# EAGLE design finalPCB2 (EAGLE 9.6.2)
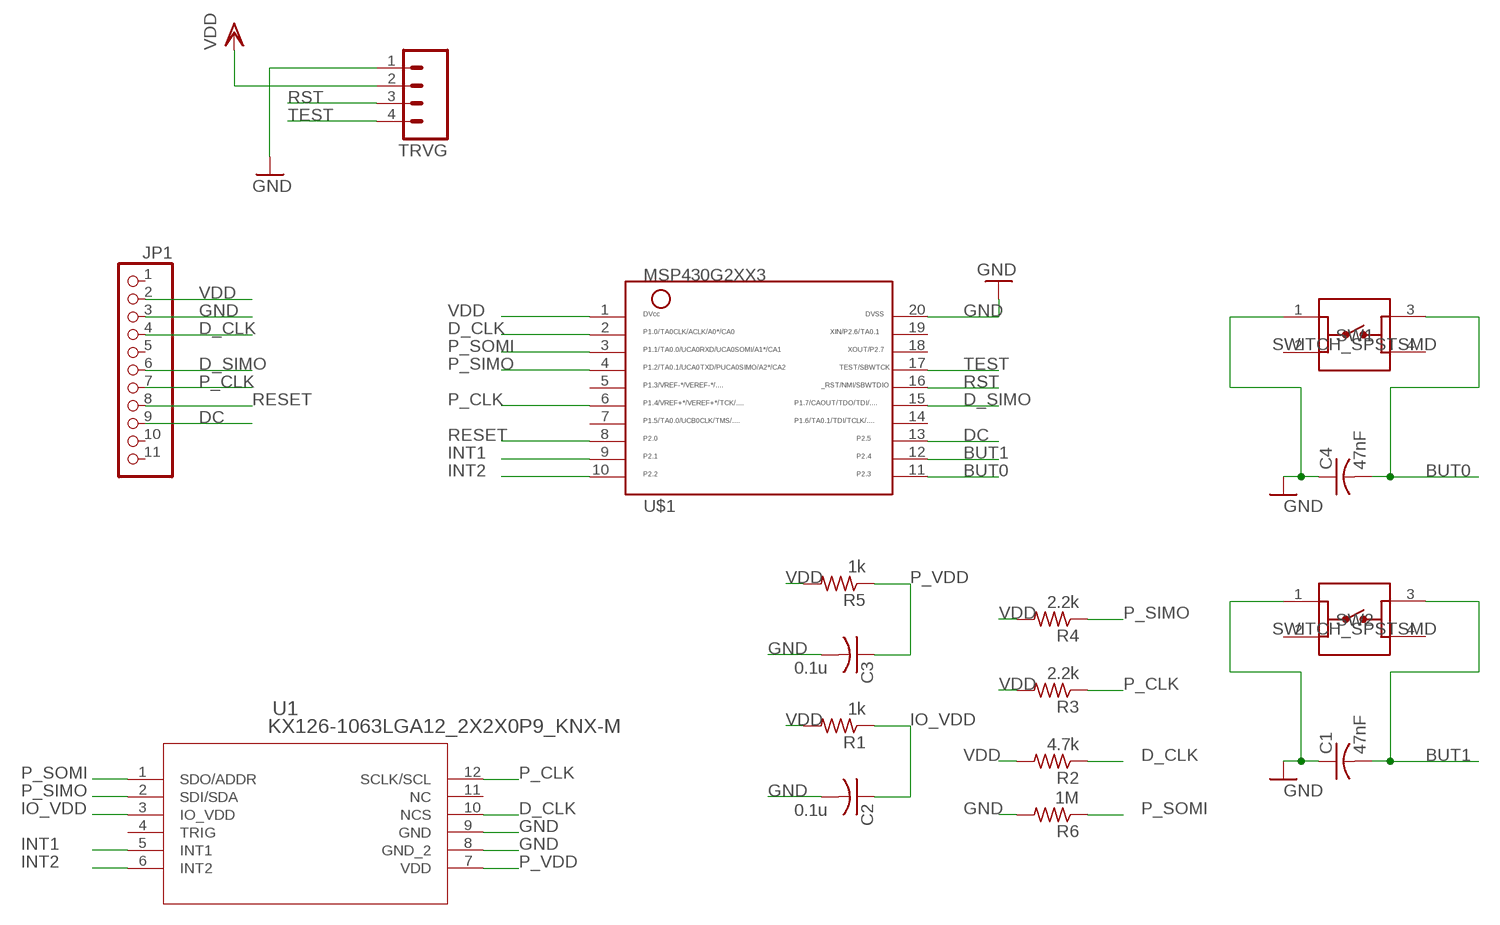
[diagram p0: schematic, sheet 1]

## Parts
C1  47nF  C-USC0603  [C0603]
C2  0.1u  C-USC0603  [C0603]
C3  0.1u  C-USC0603  [C0603]
C4  47nF  C-USC0603  [C0603]
JP1  HEADER-1X11  [1X11_ROUND]
R1  1k  R-US_R0402  [R0402]
R2  4.7k  R-US_R0402  [R0402]
R3  2.2k  R-US_R0402  [R0402]
R4  2.2k  R-US_R0402  [R0402]
R5  1k  R-US_R0402  [R0402]
R6  1M  R-US_R0402  [R0402]
SW1  SWITCH_SPSTSMD  [SW_1571563-4]
SW2  SWITCH_SPSTSMD  [SW_1571563-4]
TRVG  M04LOCK  [1X04_LOCK]
U1  KX126-1063LGA12_2X2X0P9_KNX-M  [LGA12_2X2X0P9_KNX-M]
U$1  MSP430G2XX3TSSOP  [PW20]

## Nets
BUT0: C4.2 SW1.3 U$1.11
BUT1: C1.2 SW2.3 U$1.12
D_CLK: JP1.4 R2.1 U1.10(NCS) U$1.2
D_SIMO: JP1.6 U$1.15
DC: JP1.9 U$1.13
GND: C1.1 C2.2 C3.2 C4.1 JP1.3 R6.2 SW1.1 SW2.1 TRVG.1 U1.8(GND_2) U1.9(GND) U$1.20
INT1: U1.5(INT1) U$1.9
INT2: U1.6(INT2) U$1.10
IO_VDD: C2.1 R1.1 U1.3(IO_VDD)
P_CLK: JP1.7 R3.1 U1.12(SCLK/SCL) U$1.6
P_SIMO: R4.1 U1.2(SDI/SDA) U$1.4
P_SOMI: R6.1 U1.1(SDO/ADDR) U$1.3
P_VDD: C3.1 R5.1 U1.7(VDD)
RESET: JP1.8 U$1.8
RST: TRVG.3 U$1.16
TEST: TRVG.4 U$1.17
VDD: JP1.2 R1.2 R2.2 R3.2 R4.2 R5.2 TRVG.2 U$1.1
Unconnected: JP1.1 JP1.5 JP1.10 JP1.11 SW1.2 SW1.4 SW2.2 SW2.4 U1.4(TRIG) U1.11(NC) U$1.5 U$1.7 U$1.14 U$1.18 U$1.19

## Library data of the parts
C1-C4 = rcl:C-US: CAPACITOR, American symbol; SPICEPREFIX: C
JP1 = microbuilder:HEADER-1X11
R1-R6 = rcl:R-US_: RESISTOR, American symbol; SPICEPREFIX: R
SW1 SW2 = ELEC327:SWITCH_SPST: TE Connectivity Alcoswitch, 6mm Switch Tactile OFF (ON) SPST Round Button PC Pins 0.05A 24VDC 100000Cycles 2.55N Thru-Hole Loose Through Hole Version 1825910-7 <https://www.digikey.com/en/products/detail/te-connectivity-alcoswitch-switches/1825910-7/1731414> Surface Mount Version 1571563-4 <https://www.digikey.com/en/products/detail/te-connectivity-alcoswitch-switches/1571563-4/2400231>
TRVG = Pendant:M04: Header 4 Standard 4-pin 0.1" header. Use with straight break away headers (SKU : PRT-00116), right angle break away headers (PRT-00553), swiss pins (PRT-00743), machine pins (PRT-00117), and female headers (PRT-00115). Molex polarized connector foot print use with SKU : PRT-08231 with associated crimp pins and housings.
U1 = Juan_pedometer:KX126-1063; COPYRIGHT: Copyright (C) 2021 Ultra Librarian. All rights reserved.; DIGI-KEY_PART_NUMBER_1: 1191-1058-2-ND; DIGI-KEY_PART_NUMBER_2: 1191-1058-1-ND; DIGI-KEY_PART_NUMBER_3: 1191-1058-6-ND; MANUFACTURER_PART_NUMBER: KX126-1063; MFR_NAME: Kionix
U$1 = ELEC327:MSP430G2XX3: MSP430G2XX3 PDIP (N) 20 Pin Package

## Board
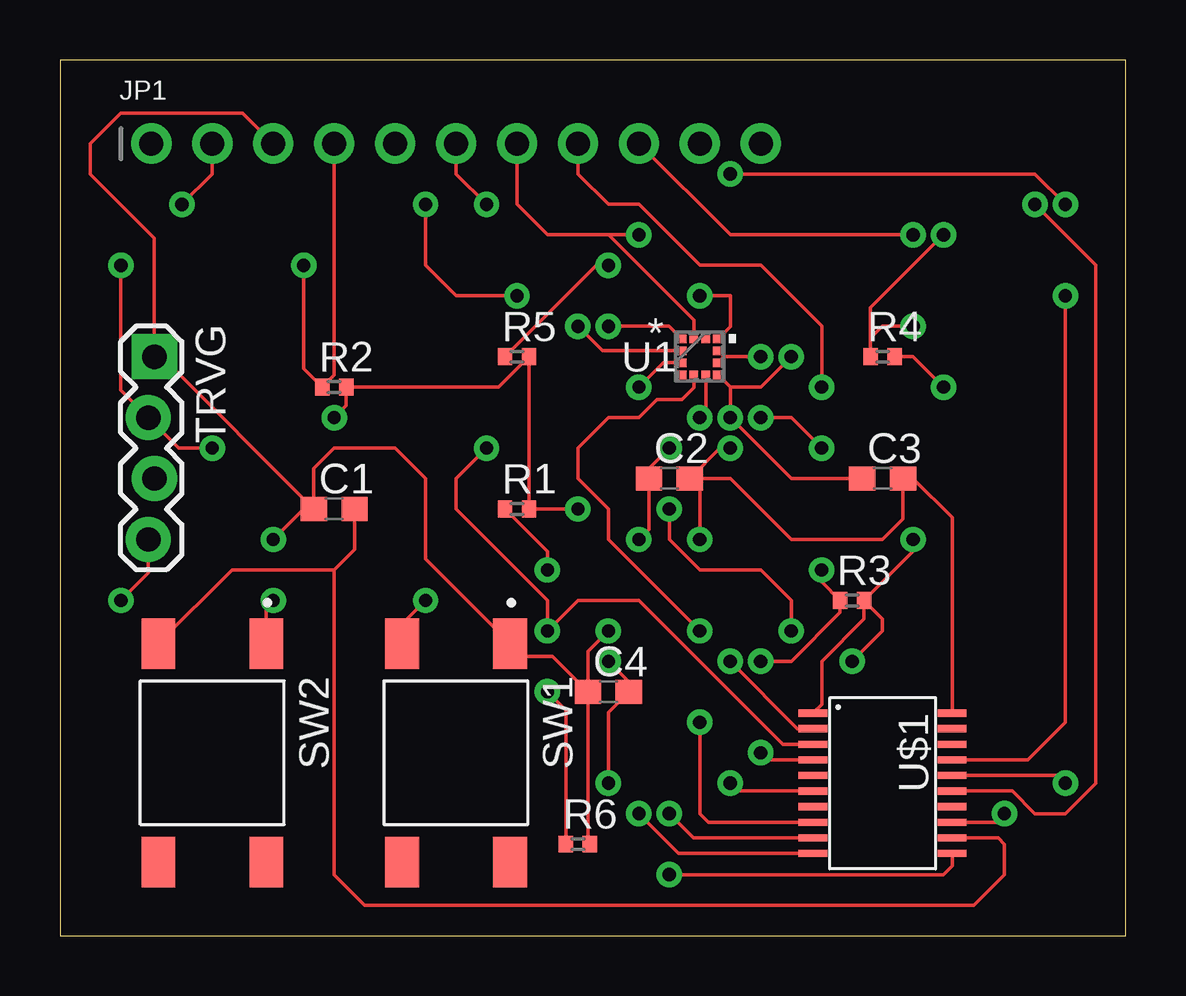
[diagram p1: board, top side]
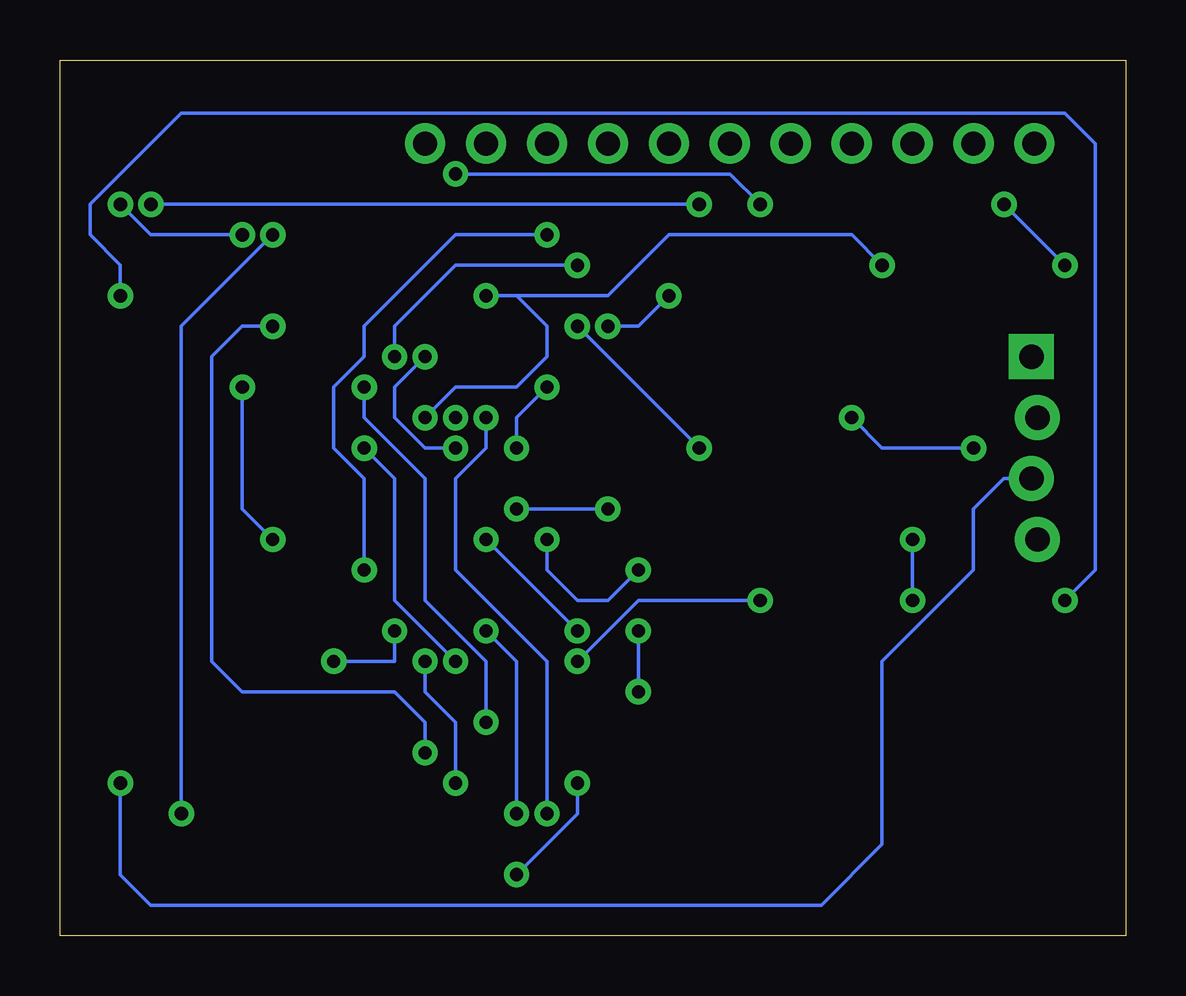
[diagram p2: board, bottom side, seen from below]

Size 44.43 x 36.5 mm. Coordinates in mm from the lower left corner, seen from the top.
Outline: 0,0 44.43,0 44.43,36.5 0,36.5 0,0
Copper layers (1*16): Top 0.035mm / dielectric 1.5mm / Bottom 0.035mm
Design rules "AdvancedCircuitsBarebones": minimum track width 6mil, minimum drill 20mil, track to track 6mil, track to pad 6mil, pad to pad 6mil, via to via 6mil, smd to smd 6mil, copper to edge 10mil, drill to drill 6mil, minimum pad ring 12mil, minimum via ring 10mil, stop-mask expansion 4mil, vias tented up to drill 25mil, thermal gap 10mil

### Footprints (pad centres in the part's own frame; a part is rotated, then mirrored left to right if it is on the bottom)
C0603 = smd 1.1 x 1: 1 -0.85,0; 2 0.85,0
1X11_ROUND = drill 1 pad 1.676: 1 -12.7,0; 2 -10.16,0; 3 -7.62,0; 4 -5.08,0; 5 -2.54,0; 6 0,0; 7 2.54,0; 8 5.08,0; 9 7.62,0; 10 10.16,0; 11 12.7,0
R0402 = smd 0.6 x 0.7: 1 -0.5,0; 2 0.5,0
SW_1571563-4 = smd 2.1 x 1.4: 1 -4.55,2.25; 2 4.55,2.25; 3 -4.55,-2.25; 4 4.55,-2.25
1X04_LOCK = drill 1.016 pad 1.88 square: 1 0,0.127 | drill 1.016 pad 1.88: 2 2.54,-0.127; 3 5.08,0.127; 4 7.62,-0.127
LGA12_2X2X0P9_KNX-M = smd 0.432 x 0.356: 1 -0.762,0.75; 2 -0.762,0.25; 3 -0.762,-0.25; 4 -0.762,-0.75; 7 0.762,-0.75; 8 0.762,-0.25; 9 0.762,0.25; 10 0.762,0.75 | smd 0.356 x 0.432: 5 -0.25,-0.787; 6 0.25,-0.787; 11 0.25,0.787; 12 -0.25,0.787
PW20 = smd 0.3 x 1.2: 1 -2.925,-2.9; 2 -2.275,-2.9; 3 -1.625,-2.9; 4 -0.975,-2.9; 5 -0.325,-2.9; 6 0.325,-2.9; 7 0.975,-2.9; 8 1.625,-2.9; 9 2.275,-2.9; 10 2.925,-2.9; 11 2.925,2.9; 12 2.275,2.9; 13 1.625,2.9; 14 0.975,2.9; 15 0.325,2.9; 16 -0.325,2.9; 17 -0.975,2.9; 18 -1.625,2.9; 19 -2.275,2.9; 20 -2.925,2.9

### Placement (x,y rotation side)
C1  11.43,17.78 0 top
C2  25.4,19.05 0 top
C3  34.29,19.05 0 top
C4  22.86,10.16 0 top
JP1  16.51,33.02 0 top
R1  19.05,17.78 0 top
R2  11.43,22.86 0 top
R3  33.02,13.97 0 top
R4  34.29,24.13 0 top
R5  19.05,24.13 0 top
R6  21.59,3.81 0 top
SW1  16.51,7.62 270 top
SW2  6.35,7.62 270 top
TRVG  3.81,24.13 270 top
U1  26.67,24.13 0 top
U$1  34.29,6.35 270 top

### Tracks (layer width: path | path; a pad name or v marks a point on that pad's centre or on a via)
BUT0  (via drill 0.55)
  Top 0.152: v15.24,13.97 14.26,12.99 SW1.3 | v22.86,11.43 23.71,10.58 C4.2 22.86,9.31 v22.86,6.35 | U$1.11 37.19,2.9 36.83,2.54 v25.4,2.54
  Bottom 0.152: v15.24,13.97 20.32,13.97 v22.86,11.43 | v25.4,2.54 22.86,5.08 v22.86,6.35
BUT1
  Top 0.152: SW2.3 7.17,15.24 11.43,15.24 | 11.43,15.24 12.28,16.09 C1.2 | U$1.12 39.1,4.08 39.37,3.81 39.37,2.54 38.1,1.27 12.7,1.27 11.43,2.54 11.43,15.24
D_CLK  (via drill 0.55)
  Top 0.152: JP1.4 11.43,23.36 R2.1 10.16,23.63 v10.16,27.94 | U$1.2 30.75,8.62 v27.94,11.43 | v31.75,20.32 30.48,21.59 v29.21,21.59 | v26.67,26.67 27.94,26.67 27.94,25.39 U1.10
  Bottom 0.152: v31.75,20.32 30.48,19.05 30.48,13.97 v27.94,11.43 | v29.21,21.59 27.94,22.86 25.4,22.86 24.13,24.13 24.13,25.4 25.4,26.67 | v10.16,27.94 11.43,29.21 19.05,29.21 21.59,26.67 25.4,26.67 | 25.4,26.67 v26.67,26.67
D_SIMO  (via drill 0.55)
  Top 0.152: v40.64,30.48 43.18,27.94 43.18,6.35 41.91,5.08 40.64,5.08 39.7,6.03 U$1.15 | v17.78,30.48 16.51,31.75 JP1.6
  Bottom 0.152: v40.64,30.48 v17.78,30.48
DC  (via drill 0.55)
  Top 0.152: v39.37,5.08 39.02,4.72 U$1.13 | v35.56,29.21 27.94,29.21 JP1.9
  Bottom 0.152: v39.37,5.08 39.37,25.4 v35.56,29.21
GND  (via drill 0.55)
  Top 0.152: C1.1 4.23,24.13 TRVG.1 3.94,29.08 1.27,31.75 1.27,33.02 2.54,34.29 7.62,34.29 JP1.3 | C2.2 27.94,19.05 30.48,16.51 34.29,16.51 35.14,17.36 C3.2 35.56,19.05 37.19,17.42 U$1.20 | SW2.1 8.6,13.68 v8.89,13.97 | v8.89,16.51 10.16,17.78 C1.1 | C2.2 27.52,20.32 v27.94,20.32 | v29.21,24.13 27.68,24.13 | 27.68,24.13 U1.9 | U1.8 27.68,24.13 | C1.1 10.58,19.47 11.43,20.32 13.97,20.32 15.24,19.05 15.24,15.69 SW1.1 19.29,11.64 20.53,11.64 C4.1 | C4.1 22.01,11.85 v22.86,12.7 | v26.67,16.51 26.67,18.63 C2.2 | R6.2 22.01,3.89 C4.1
  Bottom 0.152: v8.89,13.97 v8.89,16.51 | v27.94,20.32 29.21,20.32 30.48,21.59 30.48,22.86 v29.21,24.13 | v22.86,12.7 v26.67,16.51
INT1  (via drill 0.55)
  Top 0.152: v26.67,12.7 22.86,16.51 22.86,17.78 21.59,19.05 21.59,20.32 22.86,21.59 24.13,21.59 24.89,22.35 25.94,22.35 26.42,22.84 U1.5 | v25.4,5.08 26.41,4.08 U$1.9
  Bottom 0.152: v25.4,5.08 25.4,11.43 v26.67,12.7
INT2  (via drill 0.55)
  Top 0.152: U$1.10 25.79,3.42 v24.13,5.08 | U1.6 26.92,21.84 v26.67,21.59
  Bottom 0.152: v24.13,5.08 24.13,11.43 27.94,15.24 27.94,19.05 26.67,20.32 v26.67,21.59
IO_VDD  (via drill 0.55)
  Top 0.152: R1.1 20.32,16.01 v20.32,15.24 | v24.13,16.51 24.55,16.93 C2.1 24.55,19.47 v25.4,20.32 | U1.3 25.15,23.88 v24.13,22.86
  Bottom 0.152: v20.32,15.24 21.59,13.97 22.86,13.97 24.13,15.24 v24.13,16.51 | v24.13,22.86 25.4,21.59 v25.4,20.32
P_CLK  (via drill 0.55)
  Top 0.152: v31.75,15.24 31.75,14.74 R3.1 32.52,13.47 30.48,11.43 v29.21,11.43 | U$1.6 28.27,6.03 v27.94,6.35 | JP1.7 19.05,30.48 20.32,29.21 22.86,29.21 | 22.86,29.21 26.42,25.65 U1.12 | v24.13,29.21 22.86,29.21
  Bottom 0.152: v31.75,15.24 31.75,19.05 33.02,20.32 33.02,22.86 31.75,24.13 31.75,25.4 27.94,29.21 v24.13,29.21 | v27.94,6.35 27.94,8.89 29.21,10.16 v29.21,11.43
P_SIMO  (via drill 0.55)
  Top 0.152: v36.83,29.21 33.79,26.17 R4.1 33.79,24.9 34.29,25.4 v35.56,25.4 | v41.91,30.48 40.64,31.75 v27.94,31.75 | v15.24,30.48 15.24,27.94 16.51,26.67 v19.05,26.67 | U1.2 22.61,24.38 v21.59,25.4 | U$1.4 29.5,7.33 v29.21,7.62
  Bottom 0.152: v36.83,29.21 40.64,29.21 v41.91,30.48 | v27.94,31.75 16.51,31.75 v15.24,30.48 | v21.59,25.4 20.32,25.4 v19.05,26.67 | v29.21,7.62 29.21,8.89 30.48,10.16 36.83,10.16 38.1,11.43 38.1,24.13 36.83,25.4 v35.56,25.4
P_SOMI  (via drill 0.55)
  Top 0.152: R6.1 21.09,9.39 v20.32,10.16 | U$1.3 30.12,7.97 24.13,13.97 21.59,13.97 v20.32,12.7 20.32,13.97 16.51,17.78 16.51,19.05 v17.78,20.32 | v22.86,25.4 25.39,25.4 U1.1
  Bottom 0.152: v20.32,10.16 v20.32,12.7 | v17.78,20.32 v22.86,25.4
P_VDD  (via drill 0.55)
  Top 0.152: C3.1 30.48,19.05 v27.94,21.59 27.94,22.87 | 27.94,22.87 U1.7 | v30.48,24.13 29.21,22.86 27.95,22.86 27.94,22.87 | R5.1 22.36,27.94 v22.86,27.94
  Bottom 0.152: v30.48,24.13 30.48,25.4 27.94,27.94 v22.86,27.94
RESET  (via drill 0.55)
  Top 0.152: JP1.8 21.59,31.75 22.86,30.48 24.13,30.48 26.67,27.94 29.21,27.94 31.75,25.4 v31.75,22.86 | U$1.8 27.02,4.72 26.67,5.08 v26.67,8.89
  Bottom 0.152: v31.75,22.86 31.75,21.59 29.21,19.05 29.21,13.97 26.67,11.43 v26.67,8.89
RST  (via drill 0.55)
  Top 0.152: U$1.16 41.59,6.67 v41.91,6.35
  Bottom 0.152: TRVG.3 5.08,19.05 6.35,17.78 6.35,15.24 10.16,11.43 10.16,3.81 12.7,1.27 38.1,1.27 39.37,1.27 40.64,1.27 41.91,2.54 v41.91,6.35
TEST  (via drill 0.55)
  Top 0.152: v2.54,13.97 3.68,15.11 TRVG.4 | v41.91,26.67 41.91,8.89 40.34,7.33 U$1.17
  Bottom 0.152: v2.54,13.97 1.27,15.24 1.27,33.02 2.54,34.29 39.37,34.29 43.18,30.48 43.18,29.21 41.91,27.94 v41.91,26.67
VDD  (via drill 0.55)
  Top 0.152: v6.35,20.32 4.95,20.32 TRVG.2 2.54,22.73 v2.54,27.94 | v11.43,21.59 11.93,22.09 R2.2 18.28,22.86 R5.2 R1.2 v21.59,17.78 | R3.2 35.56,16.01 v35.56,16.51 | v36.83,22.86 35.56,24.13 R4.2 | U$1.1 31.75,9.63 31.75,11.43 33.52,13.2 R3.2 | R3.2 34.29,13.2 34.29,12.7 v33.02,11.43 | v5.08,30.48 6.35,31.75 JP1.2 | v30.48,12.7 30.48,13.97 29.21,15.24 26.67,15.24 25.4,16.51 v25.4,17.78
  Bottom 0.152: v6.35,20.32 10.16,20.32 v11.43,21.59 | v35.56,16.51 36.83,17.78 v36.83,22.86 | v2.54,27.94 v5.08,30.48 | v25.4,17.78 v21.59,17.78 | v33.02,11.43 30.48,11.43 v30.48,12.7